# Altium project RPM.PrjPCB
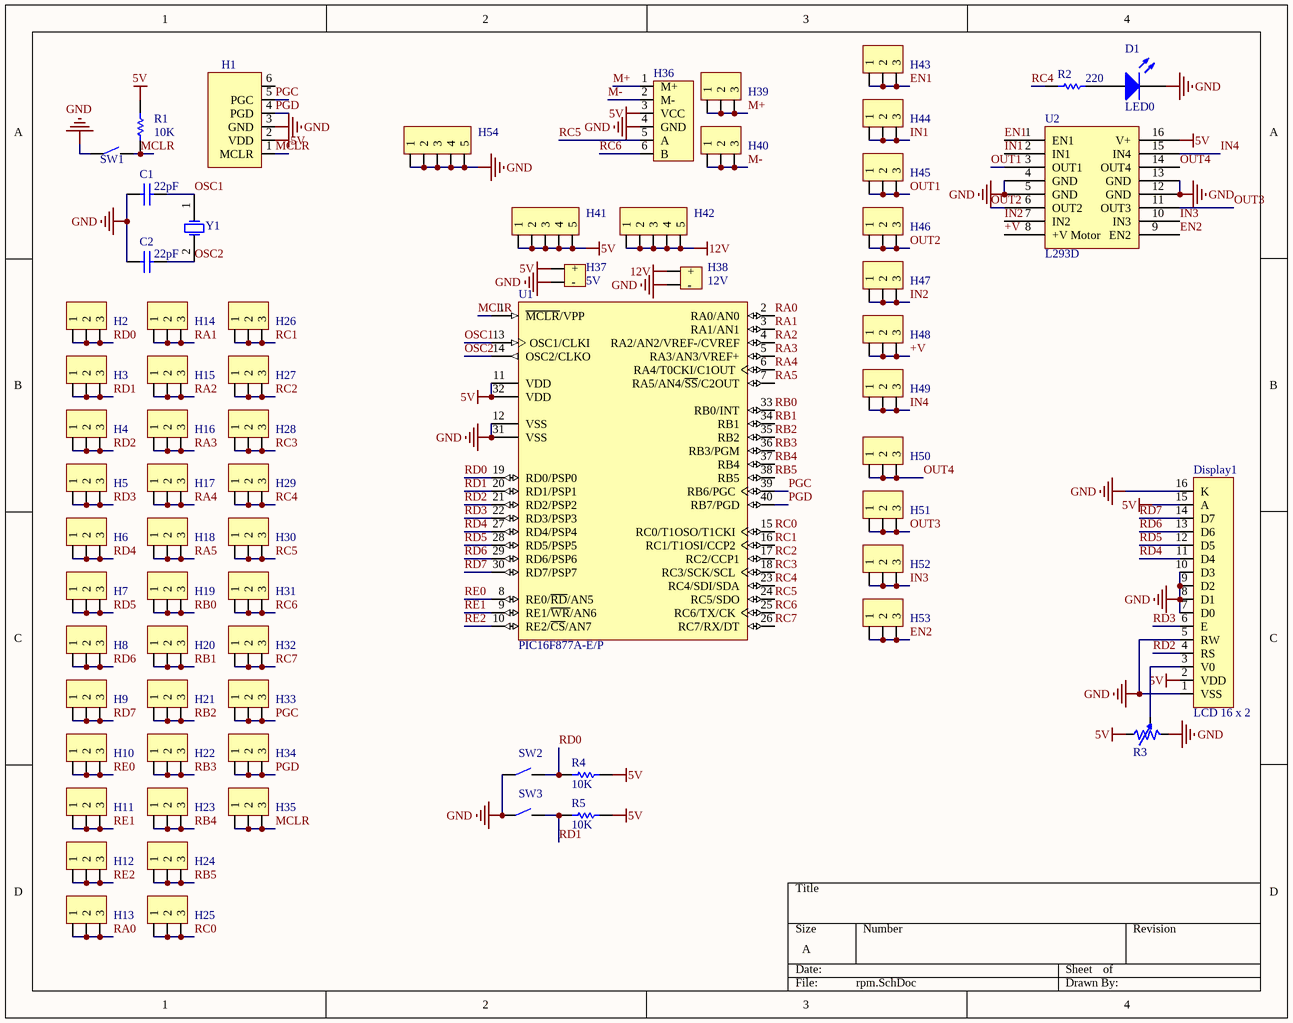
[diagram p0: rpm.SchDoc]
1 sheet, 69 parts. Net scope: global (net labels, ports and power ports of the same name join across sheets).
Board file: rpm.PcbDoc

## Sheet rpm.SchDoc
size A

### Parts
C1  value 22pF  [RAD-0.3]  (hidden comment: Cap)
C2  value 22pF  [RAD-0.3]  (hidden comment: Cap)
D1  LED0  [LED-0]
Display1  LCD 16 x 2  [LCD16x2]
H1  Programmer  [Pickit]  (value not drawn)
H2  Comment  [1X3 HEADER]  (value not drawn)
H3  Comment  [1X3 HEADER]  (value not drawn)
H4  Comment  [1X3 HEADER]  (value not drawn)
H5  Comment  [1X3 HEADER]  (value not drawn)
H6  Comment  [1X3 HEADER]  (value not drawn)
H7  Comment  [1X3 HEADER]  (value not drawn)
H8  Comment  [1X3 HEADER]  (value not drawn)
H9  Comment  [1X3 HEADER]  (value not drawn)
H10  Comment  [1X3 HEADER]  (value not drawn)
H11  Comment  [1X3 HEADER]  (value not drawn)
H12  Comment  [1X3 HEADER]  (value not drawn)
H13  Comment  [1X3 HEADER]  (value not drawn)
H14  Comment  [1X3 HEADER]  (value not drawn)
H15  Comment  [1X3 HEADER]  (value not drawn)
H16  Comment  [1X3 HEADER]  (value not drawn)
H17  Comment  [1X3 HEADER]  (value not drawn)
H18  Comment  [1X3 HEADER]  (value not drawn)
H19  Comment  [1X3 HEADER]  (value not drawn)
H20  Comment  [1X3 HEADER]  (value not drawn)
H21  Comment  [1X3 HEADER]  (value not drawn)
H22  Comment  [1X3 HEADER]  (value not drawn)
H23  Comment  [1X3 HEADER]  (value not drawn)
H24  Comment  [1X3 HEADER]  (value not drawn)
H25  Comment  [1X3 HEADER]  (value not drawn)
H26  Comment  [1X3 HEADER]  (value not drawn)
H27  Comment  [1X3 HEADER]  (value not drawn)
H28  Comment  [1X3 HEADER]  (value not drawn)
H29  Comment  [1X3 HEADER]  (value not drawn)
H30  Comment  [1X3 HEADER]  (value not drawn)
H31  Comment  [1X3 HEADER]  (value not drawn)
H32  Comment  [1X3 HEADER]  (value not drawn)
H33  Comment  [1X3 HEADER]  (value not drawn)
H34  Comment  [1X3 HEADER]  (value not drawn)
H35  Comment  [1X3 HEADER]  (value not drawn)
H36  Comment  [MOTOR ENCODER BLUE SCREW]  (value not drawn)
H37  5V  [1x2 Voltage blue screw]
H38  12V  [1x2 Voltage blue screw]
H39  Comment  [1X3 HEADER]  (value not drawn)
H40  Comment  [1X3 HEADER]  (value not drawn)
H41  Comment  [1X5 HEADER]  (value not drawn)
H42  Comment  [1X5 HEADER]  (value not drawn)
H43  Comment  [1X3 HEADER]  (value not drawn)
H44  Comment  [1X3 HEADER]  (value not drawn)
H45  Comment  [1X3 HEADER]  (value not drawn)
H46  Comment  [1X3 HEADER]  (value not drawn)
H47  Comment  [1X3 HEADER]  (value not drawn)
H48  Comment  [1X3 HEADER]  (value not drawn)
H49  Comment  [1X3 HEADER]  (value not drawn)
H50  Comment  [1X3 HEADER]  (value not drawn)
H51  Comment  [1X3 HEADER]  (value not drawn)
H52  Comment  [1X3 HEADER]  (value not drawn)
H53  Comment  [1X3 HEADER]  (value not drawn)
H54  Comment  [1X5 HEADER]  (value not drawn)
R1  value 10K  [AXIAL-0.3]  (hidden comment: Res1)
R2  value 220  [AXIAL-0.3]  (hidden comment: Res1)
R3  Potenciometar  [ADJ_RES]  (value not drawn)
R4  value 10K  [AXIAL-0.3]  (hidden comment: Res1)
R5  value 10K  [AXIAL-0.3]  (hidden comment: Res1)
SW1  Taster SMD  [Taster SMD]  (value not drawn)
SW2  Taster SMD  [Taster SMD]  (value not drawn)
SW3  Taster SMD  [Taster SMD]  (value not drawn)
U1  PIC16F877A-E/P  [PDIP600-P40]
U2  L293D  [L293D]
Y1  XTAL  [R38]  (value not drawn)

### Nets
5V: Display1.2(VDD) Display1.15(A) H1.2(VDD) H36.3(VCC) H37.1(+) H41.1 H41.2 H41.3 H41.4 H41.5 R1.1 R3.1 R4.1 R5.2 U1.11(VDD) U1.32(VDD) U2.16(V+)
12V: H38.1(+) H42.1 H42.2 H42.3 H42.4 H42.5
GND: C1.1 C2.1 D1.2(K) Display1.1(VSS) Display1.5(RW) Display1.7(D0) Display1.8(D1) Display1.9(D2) Display1.10(D3) Display1.16(K) H1.3(GND) H36.4(GND) H37.2(-) H38.2(-) H54.1 H54.2 H54.3 H54.4 H54.5 R3.2 SW1.1 SW2.1 SW3.1 U1.12(VSS) U1.31(VSS) U2.4(GND) U2.5(GND) U2.12(GND) U2.13(GND)
+V: H48.1 H48.2 H48.3 U2.8(+V_Motor)
EN1: H43.1 H43.2 H43.3 U2.1(EN1)
EN2: H53.1 H53.2 H53.3 U2.9(EN2)
IN1: H44.1 H44.2 H44.3 U2.2(IN1)
IN2: H47.1 H47.2 H47.3 U2.7(IN2)
IN3: H52.1 H52.2 H52.3 U2.10(IN3)
IN4: H49.1 H49.2 H49.3 U2.15(IN4)
M+: H36.1(M+) H39.1 H39.2 H39.3
M-: H36.2(M-) H40.1 H40.2 H40.3
MCLR: H1.1(MCLR) H35.1 H35.2 H35.3 R1.2 SW1.2 U1.1(~{MCLR}/VPP)
OSC1: C1.2 U1.13(OSC1/CLKI) Y1.1(OSC1)
OSC2: C2.2 U1.14(OSC2/CLKO) Y1.2(OSC2)
OUT1: H45.1 H45.2 H45.3 U2.3(OUT1)
OUT2: H46.1 H46.2 H46.3 U2.6(OUT2)
OUT3: H51.1 H51.2 H51.3 U2.11(OUT3)
OUT4: H50.1 H50.2 H50.3 U2.14(OUT4)
PGC: H1.5(PGC) H33.1 H33.2 H33.3 U1.39(RB6/PGC)
PGD: H1.4(PGD) H34.1 H34.2 H34.3 U1.40(RB7/PGD)
RA0: H13.1 H13.2 H13.3 U1.2(RA0/AN0)
RA1: H14.1 H14.2 H14.3 U1.3(RA1/AN1)
RA2: H15.1 H15.2 H15.3 U1.4(RA2/AN2/VREF-/CVREF)
RA3: H16.1 H16.2 H16.3 U1.5(RA3/AN3/VREF+)
RA4: H17.1 H17.2 H17.3 U1.6(RA4/T0CKI/C1OUT)
RA5: H18.1 H18.2 H18.3 U1.7(RA5/AN4/~{SS}/C2OUT)
RB0: H19.1 H19.2 H19.3 U1.33(RB0/INT)
RB1: H20.1 H20.2 H20.3 U1.34(RB1)
RB2: H21.1 H21.2 H21.3 U1.35(RB2)
RB3: H22.1 H22.2 H22.3 U1.36(RB3/PGM)
RB4: H23.1 H23.2 H23.3 U1.37(RB4)
RB5: H24.1 H24.2 H24.3 U1.38(RB5)
RC0: H25.1 H25.2 H25.3 U1.15(RC0/T1OSO/T1CKI)
RC1: H26.1 H26.2 H26.3 U1.16(RC1/T1OSI/CCP2)
RC2: H27.1 H27.2 H27.3 U1.17(RC2/CCP1)
RC3: H28.1 H28.2 H28.3 U1.18(RC3/SCK/SCL)
RC4: H29.1 H29.2 H29.3 R2.1 U1.23(RC4/SDI/SDA)
RC5: H30.1 H30.2 H30.3 H36.5(A) U1.24(RC5/SDO)
RC6: H31.1 H31.2 H31.3 H36.6(B) U1.25(RC6/TX/CK)
RC7: H32.1 H32.2 H32.3 U1.26(RC7/RX/DT)
RD0: H2.1 H2.2 H2.3 R4.2 SW2.2 U1.19(RD0/PSP0)
RD1: H3.1 H3.2 H3.3 R5.1 SW3.2 U1.20(RD1/PSP1)
RD2: Display1.4(RS) H4.1 H4.2 H4.3 U1.21(RD2/PSP2)
RD3: Display1.6(E) H5.1 H5.2 H5.3 U1.22(RD3/PSP3)
RD4: Display1.11(D4) H6.1 H6.2 H6.3 U1.27(RD4/PSP4)
RD5: Display1.12(D5) H7.1 H7.2 H7.3 U1.28(RD5/PSP5)
RD6: Display1.13(D6) H8.1 H8.2 H8.3 U1.29(RD6/PSP6)
RD7: Display1.14(D7) H9.1 H9.2 H9.3 U1.30(RD7/PSP7)
RE0: H10.1 H10.2 H10.3 U1.8(RE0/~{RD}/AN5)
RE1: H11.1 H11.2 H11.3 U1.9(RE1/~{WR}/AN6)
RE2: H12.1 H12.2 H12.3 U1.10(RE2/~{CS}/AN7)
NetD1_1: D1.1(A) R2.2
NetDisplay1_3: Display1.3(V0) R3.3

Not connected (* = marked no-connect by the designer): H1 6

### Library data of the parts
C1 C2 = Cap: Capacitor; Published: 8-Jun-2000; LatestRevisionDate: 17-Jul-2002; LatestRevisionNote: Re-released for DXP Platform.; PackageReference: RAD-0.3; Publisher: Altium Limited; PackageDescription: Radial Cap, Thru-Hole; 2 Leads; 0.3 in Pin Spacing
D1 = LED0: Typical INFRARED GaAs LED; Published: 8-Jun-2000; LatestRevisionDate: 08-Jul-2005; LatestRevisionNote: Mech Layer 1 removed.; PackageReference: LED-0; Publisher: Altium Limited; PackageDescription: LED; 2 Leads
H1 = PICKIT
H2-H35 H39 H40 H43-H53 = 1X3 Header
H36 = Motor encoder blue screw
H37 H38 = 1x2 Voltage blue screw
H41 H42 H54 = 1X5 Header
R1 R2 R4 R5 = Res1: Resistor; Published: 8-Jun-2000; LatestRevisionDate: 17-Jul-2002; LatestRevisionNote: Re-released for DXP Platform.; PackageReference: AXIAL-0.3; Publisher: Altium Limited; PackageDescription: Axial Device, Thru-Hole; 2 Leads; 0.3 in Pin Spacing
R3 = ADJ_RES
SW1-SW3 = Taster SMD: Configuration_Pole-Throw: Single Pole - Single Throw; MP: 2-1437565-8; MF: TE Connectivity; Contact_Current_Rating: 50 mA; Package: None; TE_purchase_URL: https://www.te.com/usa-en/product-2-1437565-8.html?te_bu=Cor&te_type=disp&te_campaign=seda_glo_cor-seda-global-disp-prtnr-fy19-seda-model-bom-cta_sma-317_1&elqCampaignId=32493; Price: None; SnapEDA_Link: https://www.snapeda.com/parts/2-1437565-8/TE%20Connectivity%20ALCOSWITCH%20Switches/view-part/455292/?ref=snap; Availability: Unavailable; Value: *
U1 = PIC16F877A-E/P: Enhanced FLASH Microcontroller, 8K (x14-Bit words) FLASH, 368 Bytes RAM, 40-Pin PDIP, Standard VDD Range, Extended Temperature; ComponentAvailability: Unknown. Contact manufacturer to determine status.; Published: 11-Oct-2004; LatestRevisionDate: 29-Jan-2009; LatestRevisionNote: Sch. layout revised. 3D Model Removed.; DatasheetVersion: revB, Oct-2003; PackageVersion: revBB, Aug-2009; PackageReference: PDIP600-P40; Publisher: Altium Limited; PackageDescription: 40-Lead Plastic Dual In-Line (P) - 600 mil Body [PDIP]; Supplier 1: Digi-Key; Supplier Part Number 1: PIC16F877A-E/P-ND; Supplier 2: Farnell; Supplier Part Number 2: 1567990; ComponentLink1Description: Datasheet; ComponentLink1URL: http://ww1.microchip.com/downloads/en/DeviceDoc/39582b.pdf; ComponentLink2Description: Packaging Specification; ComponentLink2URL: http://www.microchip.com/stellent/groups/techpub_sg/documents/packagingspec/en012702.pdf; ComponentLink3Description: Microchip.com Home; ComponentLink3URL: http://www.microchip.com/
U2 = L293D: Motor Driver
Y1 = XTAL: Crystal Oscillator; Published: 8-Jun-2000; LatestRevisionDate: 17-Jul-2002; LatestRevisionNote: Re-released for DXP Platform.; PackageReference: R38; Publisher: Altium Limited; PackageDescription: Crystal, Thru-Hole; 2 Leads; Body 3.1 x 8.2 mm (Dia.xH)